# Altium schematic sheet FPGA_Banks_47_48_HP_FMC.SchDoc: Sayma AMC
size 420 x 297 mm; $$Internal___BlkDate: 0:12:25_2-9-18; $$Internal_NAME_PLACEHOLDER: a3sheet; $$Internal_Resolution: 00001mm; $$NotCommonProperty_@NAME: FPGA_XCKU040FFVA1156; $$NotCommonProperty_@PRINTORDER: 17; $$NotCommonProperty_@SHEET: FPGA Banks 47 48 HP FMC; $$NotCommonProperty_@SHEETTOTAL: 30; CmpIndex: 989; Drawing Author: G.Kasprowicz; Drawing Number: Sayma AMC; Drawing Project: AMC FMC Carrier Board; Drawing Revision: 2.0; SymIndex: 2141; CheckedBy: P.Kulik,T.Przywozki,W.Ruclo; Author: G.Kasprowicz; CompanyName: WUT ISE; DrawnBy: G.Kasprowicz; Organization: WUT ISE; Address1: PW ISE; Address2: Nowowiejska 15/19 00-665 Warsaw; Address3: gkasprow@gmail.com; DocumentNumber: 25; Revision: 2; SheetNumber: 25; SheetTotal: 32; ModifiedBy: -; CheckedDate: -; Title2: FPGA banks 47 & 48 - FMC; DivGrp: WUT ISE; Designer: G.Kasprowicz; ModifiedDate: -; ProjectName: Sensor Box
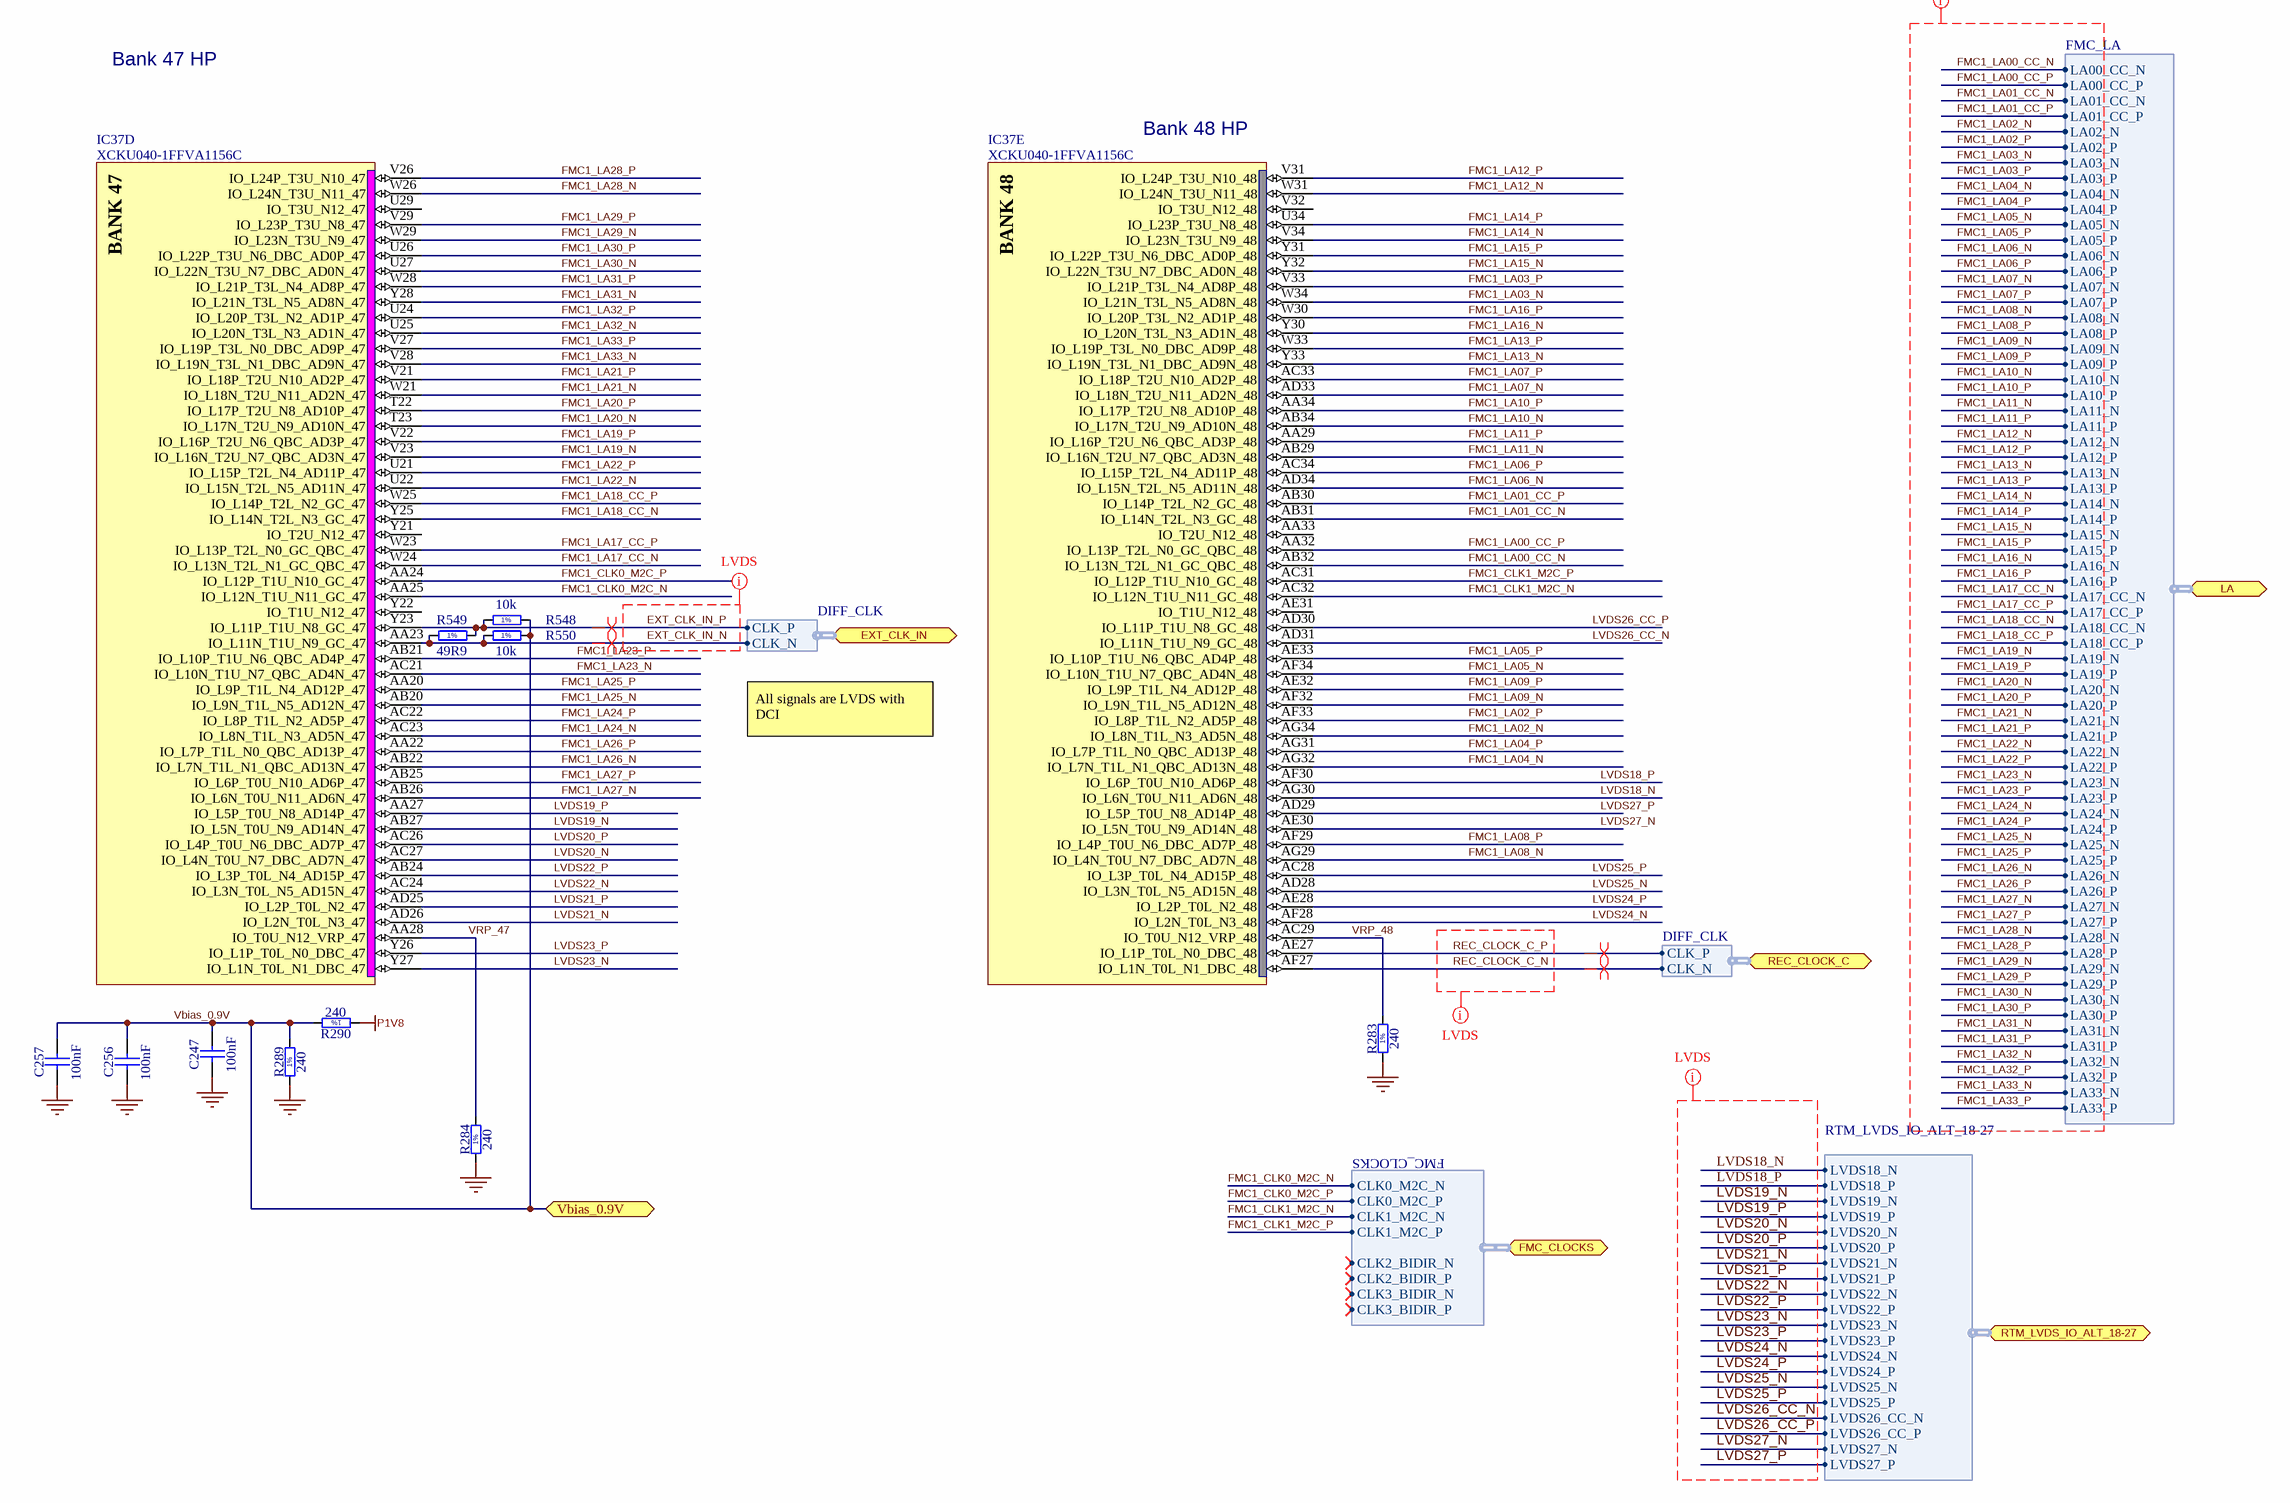
[diagram p0: FPGA_Banks_47_48_HP_FMC.SchDoc]

## Parts
C247  100nF  [CAPC0603X33N]
C256  100nF  [CAPC0603X33N]
C257  100nF  [CAPC0603X33N]
IC37  XCKU040-1FFVA1156C  [BGA1156C100P34X34_3500X3500X350]  (parts D,E of 22)
R283  240  [RESC1005X40N]
R284  240  [RESC1005X40N]
R289  240  [RESC1005X40N]
R290  240  [RESC1005X40N]
R548  10k  [RESC1005X40N]
R549  49R9  [RESC1005X40N]
R550  10k  [RESC1005X40N]

## Ports
EXT_CLK_IN (bidir, harness DIFF_CLK), FMC_CLOCKS (bidir, harness FMC_CLOCKS), LA (bidir, harness FMC_LA), REC_CLOCK_C (bidir, harness DIFF_CLK), RTM_LVDS_IO_ALT_18-27 (bidir, harness RTM_LVDS_IO_ALT_18-27), Vbias_0.9V (bidir)

## Harnesses
RTM_LVDS_IO_ALT_18-27: LVDS19_N, LVDS19_P, LVDS20_N, LVDS20_P, LVDS21_N, LVDS21_P, LVDS22_N, LVDS22_P, LVDS23_N, LVDS23_P, LVDS24_N, LVDS24_P, LVDS25_N, LVDS25_P, LVDS26_CC_N, LVDS26_CC_P, LVDS27_N, LVDS27_P, LVDS18_N, LVDS18_P
FMC_LA: LA00_CC_N, LA00_CC_P, LA01_CC_N, LA01_CC_P, LA02_N, LA02_P, LA03_N, LA03_P, LA04_N, LA04_P, LA05_N, LA05_P, LA06_N, LA06_P, LA07_N, LA07_P, LA08_N, LA08_P, LA09_N, LA09_P, LA10_N, LA10_P, LA11_N, LA11_P, LA12_N, LA12_P, LA13_N, LA13_P, LA14_N, LA14_P, LA15_N, LA15_P, LA16_N, LA16_P, LA17_CC_N, LA17_CC_P, LA18_CC_N, LA18_CC_P, LA19_N, LA19_P, LA20_N, LA20_P, LA21_N, LA21_P, LA22_N, LA22_P, LA23_N, LA23_P, LA24_N, LA25_N, LA25_P, LA24_P, LA26_N, LA26_P, LA27_N, LA27_P, LA28_N, LA28_P, LA29_N, LA29_P, LA30_N, LA30_P, LA31_N, LA31_P, LA32_N, LA32_P, LA33_N, LA33_P
FMC_CLOCKS: CLK0_M2C_N, CLK0_M2C_P, CLK1_M2C_N, CLK1_M2C_P, CLK2_BIDIR_N, CLK2_BIDIR_P, CLK3_BIDIR_N, CLK3_BIDIR_P
DIFF_CLK: CLK_N, CLK_P

## Nets
GND: C247.2 C256.2 C257.2 R283.1 R284.1 R289.1
P1V8: R290.1
EXT_CLK_IN_N: IC37.AA23(IO_L11N_T1U_N9_GC_47) R549.1 R550.1 ; port EXT_CLK_IN.CLK_N
EXT_CLK_IN_P: IC37.Y23(IO_L11P_T1U_N8_GC_47) R548.1 R549.2 ; port EXT_CLK_IN.CLK_P
FMC1_CLK0_M2C_N: IC37.AA25(IO_L12N_T1U_N11_GC_47) ; port FMC_CLOCKS.CLK0_M2C_N
FMC1_CLK0_M2C_P: IC37.AA24(IO_L12P_T1U_N10_GC_47) ; port FMC_CLOCKS.CLK0_M2C_P
FMC1_CLK1_M2C_N: IC37.AC32(IO_L12N_T1U_N11_GC_48) ; port FMC_CLOCKS.CLK1_M2C_N
FMC1_CLK1_M2C_P: IC37.AC31(IO_L12P_T1U_N10_GC_48) ; port FMC_CLOCKS.CLK1_M2C_P
FMC1_LA00_CC_N: IC37.AB32(IO_L13N_T2L_N1_GC_QBC_48) ; port LA.LA00_CC_N
FMC1_LA00_CC_P: IC37.AA32(IO_L13P_T2L_N0_GC_QBC_48) ; port LA.LA00_CC_P
FMC1_LA01_CC_N: IC37.AB31(IO_L14N_T2L_N3_GC_48) ; port LA.LA01_CC_N
FMC1_LA01_CC_P: IC37.AB30(IO_L14P_T2L_N2_GC_48) ; port LA.LA01_CC_P
FMC1_LA02_N: IC37.AG34(IO_L8N_T1L_N3_AD5N_48) ; port LA.LA02_N
FMC1_LA02_P: IC37.AF33(IO_L8P_T1L_N2_AD5P_48) ; port LA.LA02_P
FMC1_LA03_N: IC37.W34(IO_L21N_T3L_N5_AD8N_48) ; port LA.LA03_N
FMC1_LA03_P: IC37.V33(IO_L21P_T3L_N4_AD8P_48) ; port LA.LA03_P
FMC1_LA04_N: IC37.AG32(IO_L7N_T1L_N1_QBC_AD13N_48) ; port LA.LA04_N
FMC1_LA04_P: IC37.AG31(IO_L7P_T1L_N0_QBC_AD13P_48) ; port LA.LA04_P
FMC1_LA05_N: IC37.AF34(IO_L10N_T1U_N7_QBC_AD4N_48) ; port LA.LA05_N
FMC1_LA05_P: IC37.AE33(IO_L10P_T1U_N6_QBC_AD4P_48) ; port LA.LA05_P
FMC1_LA06_N: IC37.AD34(IO_L15N_T2L_N5_AD11N_48) ; port LA.LA06_N
FMC1_LA06_P: IC37.AC34(IO_L15P_T2L_N4_AD11P_48) ; port LA.LA06_P
FMC1_LA07_N: IC37.AD33(IO_L18N_T2U_N11_AD2N_48) ; port LA.LA07_N
FMC1_LA07_P: IC37.AC33(IO_L18P_T2U_N10_AD2P_48) ; port LA.LA07_P
FMC1_LA08_N: IC37.AG29(IO_L4N_T0U_N7_DBC_AD7N_48) ; port LA.LA08_N
FMC1_LA08_P: IC37.AF29(IO_L4P_T0U_N6_DBC_AD7P_48) ; port LA.LA08_P
FMC1_LA09_N: IC37.AF32(IO_L9N_T1L_N5_AD12N_48) ; port LA.LA09_N
FMC1_LA09_P: IC37.AE32(IO_L9P_T1L_N4_AD12P_48) ; port LA.LA09_P
FMC1_LA10_N: IC37.AB34(IO_L17N_T2U_N9_AD10N_48) ; port LA.LA10_N
FMC1_LA10_P: IC37.AA34(IO_L17P_T2U_N8_AD10P_48) ; port LA.LA10_P
FMC1_LA11_N: IC37.AB29(IO_L16N_T2U_N7_QBC_AD3N_48) ; port LA.LA11_N
FMC1_LA11_P: IC37.AA29(IO_L16P_T2U_N6_QBC_AD3P_48) ; port LA.LA11_P
FMC1_LA12_N: IC37.W31(IO_L24N_T3U_N11_48) ; port LA.LA12_N
FMC1_LA12_P: IC37.V31(IO_L24P_T3U_N10_48) ; port LA.LA12_P
FMC1_LA13_N: IC37.Y33(IO_L19N_T3L_N1_DBC_AD9N_48) ; port LA.LA13_N
FMC1_LA13_P: IC37.W33(IO_L19P_T3L_N0_DBC_AD9P_48) ; port LA.LA13_P
FMC1_LA14_N: IC37.V34(IO_L23N_T3U_N9_48) ; port LA.LA14_N
FMC1_LA14_P: IC37.U34(IO_L23P_T3U_N8_48) ; port LA.LA14_P
FMC1_LA15_N: IC37.Y32(IO_L22N_T3U_N7_DBC_AD0N_48) ; port LA.LA15_N
FMC1_LA15_P: IC37.Y31(IO_L22P_T3U_N6_DBC_AD0P_48) ; port LA.LA15_P
FMC1_LA16_N: IC37.Y30(IO_L20N_T3L_N3_AD1N_48) ; port LA.LA16_N
FMC1_LA16_P: IC37.W30(IO_L20P_T3L_N2_AD1P_48) ; port LA.LA16_P
FMC1_LA17_CC_N: IC37.W24(IO_L13N_T2L_N1_GC_QBC_47) ; port LA.LA17_CC_N
FMC1_LA17_CC_P: IC37.W23(IO_L13P_T2L_N0_GC_QBC_47) ; port LA.LA17_CC_P
FMC1_LA18_CC_N: IC37.Y25(IO_L14N_T2L_N3_GC_47) ; port LA.LA18_CC_N
FMC1_LA18_CC_P: IC37.W25(IO_L14P_T2L_N2_GC_47) ; port LA.LA18_CC_P
FMC1_LA19_N: IC37.V23(IO_L16N_T2U_N7_QBC_AD3N_47) ; port LA.LA19_N
FMC1_LA19_P: IC37.V22(IO_L16P_T2U_N6_QBC_AD3P_47) ; port LA.LA19_P
FMC1_LA20_N: IC37.T23(IO_L17N_T2U_N9_AD10N_47) ; port LA.LA20_N
FMC1_LA20_P: IC37.T22(IO_L17P_T2U_N8_AD10P_47) ; port LA.LA20_P
FMC1_LA21_N: IC37.W21(IO_L18N_T2U_N11_AD2N_47) ; port LA.LA21_N
FMC1_LA21_P: IC37.V21(IO_L18P_T2U_N10_AD2P_47) ; port LA.LA21_P
FMC1_LA22_N: IC37.U22(IO_L15N_T2L_N5_AD11N_47) ; port LA.LA22_N
FMC1_LA22_P: IC37.U21(IO_L15P_T2L_N4_AD11P_47) ; port LA.LA22_P
FMC1_LA23_N: IC37.AC21(IO_L10N_T1U_N7_QBC_AD4N_47) ; port LA.LA23_N
FMC1_LA23_P: IC37.AB21(IO_L10P_T1U_N6_QBC_AD4P_47) ; port LA.LA23_P
FMC1_LA24_N: IC37.AC23(IO_L8N_T1L_N3_AD5N_47) ; port LA.LA24_N
FMC1_LA24_P: IC37.AC22(IO_L8P_T1L_N2_AD5P_47) ; port LA.LA24_P
FMC1_LA25_N: IC37.AB20(IO_L9N_T1L_N5_AD12N_47) ; port LA.LA25_N
FMC1_LA25_P: IC37.AA20(IO_L9P_T1L_N4_AD12P_47) ; port LA.LA25_P
FMC1_LA26_N: IC37.AB22(IO_L7N_T1L_N1_QBC_AD13N_47) ; port LA.LA26_N
FMC1_LA26_P: IC37.AA22(IO_L7P_T1L_N0_QBC_AD13P_47) ; port LA.LA26_P
FMC1_LA27_N: IC37.AB26(IO_L6N_T0U_N11_AD6N_47) ; port LA.LA27_N
FMC1_LA27_P: IC37.AB25(IO_L6P_T0U_N10_AD6P_47) ; port LA.LA27_P
FMC1_LA28_N: IC37.W26(IO_L24N_T3U_N11_47) ; port LA.LA28_N
FMC1_LA28_P: IC37.V26(IO_L24P_T3U_N10_47) ; port LA.LA28_P
FMC1_LA29_N: IC37.W29(IO_L23N_T3U_N9_47) ; port LA.LA29_N
FMC1_LA29_P: IC37.V29(IO_L23P_T3U_N8_47) ; port LA.LA29_P
FMC1_LA30_N: IC37.U27(IO_L22N_T3U_N7_DBC_AD0N_47) ; port LA.LA30_N
FMC1_LA30_P: IC37.U26(IO_L22P_T3U_N6_DBC_AD0P_47) ; port LA.LA30_P
FMC1_LA31_N: IC37.Y28(IO_L21N_T3L_N5_AD8N_47) ; port LA.LA31_N
FMC1_LA31_P: IC37.W28(IO_L21P_T3L_N4_AD8P_47) ; port LA.LA31_P
FMC1_LA32_N: IC37.U25(IO_L20N_T3L_N3_AD1N_47) ; port LA.LA32_N
FMC1_LA32_P: IC37.U24(IO_L20P_T3L_N2_AD1P_47) ; port LA.LA32_P
FMC1_LA33_N: IC37.V28(IO_L19N_T3L_N1_DBC_AD9N_47) ; port LA.LA33_N
FMC1_LA33_P: IC37.V27(IO_L19P_T3L_N0_DBC_AD9P_47) ; port LA.LA33_P
LVDS18_N: IC37.AG30(IO_L6N_T0U_N11_AD6N_48) ; port RTM_LVDS_IO_ALT_18-27.LVDS18_N
LVDS18_P: IC37.AF30(IO_L6P_T0U_N10_AD6P_48) ; port RTM_LVDS_IO_ALT_18-27.LVDS18_P
LVDS19_N: IC37.AB27(IO_L5N_T0U_N9_AD14N_47) ; port RTM_LVDS_IO_ALT_18-27.LVDS19_N
LVDS19_P: IC37.AA27(IO_L5P_T0U_N8_AD14P_47) ; port RTM_LVDS_IO_ALT_18-27.LVDS19_P
LVDS20_N: IC37.AC27(IO_L4N_T0U_N7_DBC_AD7N_47) ; port RTM_LVDS_IO_ALT_18-27.LVDS20_N
LVDS20_P: IC37.AC26(IO_L4P_T0U_N6_DBC_AD7P_47) ; port RTM_LVDS_IO_ALT_18-27.LVDS20_P
LVDS21_N: IC37.AD26(IO_L2N_T0L_N3_47) ; port RTM_LVDS_IO_ALT_18-27.LVDS21_N
LVDS21_P: IC37.AD25(IO_L2P_T0L_N2_47) ; port RTM_LVDS_IO_ALT_18-27.LVDS21_P
LVDS22_N: IC37.AC24(IO_L3N_T0L_N5_AD15N_47) ; port RTM_LVDS_IO_ALT_18-27.LVDS22_N
LVDS22_P: IC37.AB24(IO_L3P_T0L_N4_AD15P_47) ; port RTM_LVDS_IO_ALT_18-27.LVDS22_P
LVDS23_N: IC37.Y27(IO_L1N_T0L_N1_DBC_47) ; port RTM_LVDS_IO_ALT_18-27.LVDS23_N
LVDS23_P: IC37.Y26(IO_L1P_T0L_N0_DBC_47) ; port RTM_LVDS_IO_ALT_18-27.LVDS23_P
LVDS24_N: IC37.AF28(IO_L2N_T0L_N3_48) ; port RTM_LVDS_IO_ALT_18-27.LVDS24_N
LVDS24_P: IC37.AE28(IO_L2P_T0L_N2_48) ; port RTM_LVDS_IO_ALT_18-27.LVDS24_P
LVDS25_N: IC37.AD28(IO_L3N_T0L_N5_AD15N_48) ; port RTM_LVDS_IO_ALT_18-27.LVDS25_N
LVDS25_P: IC37.AC28(IO_L3P_T0L_N4_AD15P_48) ; port RTM_LVDS_IO_ALT_18-27.LVDS25_P
LVDS26_CC_N: IC37.AD31(IO_L11N_T1U_N9_GC_48) ; port RTM_LVDS_IO_ALT_18-27.LVDS26_CC_N
LVDS26_CC_P: IC37.AD30(IO_L11P_T1U_N8_GC_48) ; port RTM_LVDS_IO_ALT_18-27.LVDS26_CC_P
LVDS27_N: IC37.AE30(IO_L5N_T0U_N9_AD14N_48) ; port RTM_LVDS_IO_ALT_18-27.LVDS27_N
LVDS27_P: IC37.AD29(IO_L5P_T0U_N8_AD14P_48) ; port RTM_LVDS_IO_ALT_18-27.LVDS27_P
REC_CLOCK_C_N: IC37.AF27(IO_L1N_T0L_N1_DBC_48) ; port REC_CLOCK_C.CLK_N
REC_CLOCK_C_P: IC37.AE27(IO_L1P_T0L_N0_DBC_48) ; port REC_CLOCK_C.CLK_P
Vbias_0.9V: C247.1 C256.1 C257.1 R289.2 R290.2 R548.2 R550.2 ; port Vbias_0.9V
VRP_47: IC37.AA28(IO_T0U_N12_VRP_47) R284.2
VRP_48: IC37.AC29(IO_T0U_N12_VRP_48) R283.2

Not connected (* = marked no-connect by the designer): IC37 AA33(IO_T2U_N12_48) AE31(IO_T1U_N12_48) U29(IO_T3U_N12_47) V32(IO_T3U_N12_48) Y21(IO_T2U_N12_47) Y22(IO_T1U_N12_47)

## Layout directives
differential pair: EXT_CLK_IN_N, EXT_CLK_IN_P, REC_CLOCK_C_N, REC_CLOCK_C_P
net class LVDS: EXT_CLK_IN_N, EXT_CLK_IN_P, LVDS18_N, LVDS18_P, LVDS19_N, LVDS19_P, LVDS20_N, LVDS20_P, LVDS21_N, LVDS21_P, LVDS22_N, LVDS22_P, LVDS23_N, LVDS23_P, LVDS24_N, LVDS24_P, LVDS25_N, LVDS25_P, LVDS26_CC_N, LVDS26_CC_P, LVDS27_N, LVDS27_P, REC_CLOCK_C_N, REC_CLOCK_C_P
net class LVDS_FMC: FMC1_LA00_CC_N, FMC1_LA00_CC_P, FMC1_LA01_CC_N, FMC1_LA01_CC_P, FMC1_LA02_N, FMC1_LA02_P, FMC1_LA03_N, FMC1_LA03_P, FMC1_LA04_N, FMC1_LA04_P, FMC1_LA05_N, FMC1_LA05_P, FMC1_LA06_N, FMC1_LA06_P, FMC1_LA07_N, FMC1_LA07_P, FMC1_LA08_N, FMC1_LA08_P, FMC1_LA09_N, FMC1_LA09_P, FMC1_LA10_N, FMC1_LA10_P, FMC1_LA11_N, FMC1_LA11_P, FMC1_LA12_N, FMC1_LA12_P, FMC1_LA13_N, FMC1_LA13_P, FMC1_LA14_N, FMC1_LA14_P, FMC1_LA15_N, FMC1_LA15_P, FMC1_LA16_N, FMC1_LA16_P, FMC1_LA17_CC_N, FMC1_LA17_CC_P, FMC1_LA18_CC_N, FMC1_LA18_CC_P, FMC1_LA19_N, FMC1_LA19_P, FMC1_LA20_N, FMC1_LA20_P, FMC1_LA21_N, FMC1_LA21_P, FMC1_LA22_N, FMC1_LA22_P, FMC1_LA23_N, FMC1_LA23_P, FMC1_LA24_N, FMC1_LA24_P, FMC1_LA25_N, FMC1_LA25_P, FMC1_LA26_N, FMC1_LA26_P, FMC1_LA27_N, FMC1_LA27_P, FMC1_LA28_N, FMC1_LA28_P, FMC1_LA29_N, FMC1_LA29_P, FMC1_LA30_N, FMC1_LA30_P, FMC1_LA31_N, FMC1_LA31_P, FMC1_LA32_N, FMC1_LA32_P, FMC1_LA33_N, FMC1_LA33_P

## Notes on the sheet
- Bank 47 HP
- (near IC37) Bank 48 HP
- All signals are LVDS with DCI
- Project/Equipment
- Document
- Designer
- Drawn by
- Check.by
- Copyright WUT ISE 2018.
  This documentation describes Open Hardware and is licensed under the CERN OHL v.1.1. You may redistribute and modify this documentation under the terms of the CERN OHL v.1.1. (http://ohwr.org/CERNOHL). This documentation is distributed WITHOUT ANY EXPRESS OR IMPLIED WARRANTY, INCLUDING OF MERCHANTABILITY, SATISFACTORY QUALITY AND FITNESS FOR A PARTICULAR PURPOSE. Please see the CERN OHL v.1.1 for applicable conditions.
- Contact
- File
- Last Mod.
- Print Date
- Sheet
- Size
- A3
- of
- Rev
- (in symbol R0402_10K_1%_0.0625W_100PPM) 1%
- (in symbol R0402_49R9_1%_0.0625W_100PPM) 1%
- (in symbol R0402_240R_1%_0.0625W_100PPM) 1%
- (in symbol XCKU040-1FFVA1156C, part D) BANK 47
- (in symbol XCKU040-1FFVA1156C, part E) BANK 48

## Library data of the parts
C247 C256 C257 = CC0201_100NF_6.3V_10%_X5R: Non-polarised capacitor; Manufacturer: GENERIC; Part Description: SMD Multilayer Chip Ceramic Capacitor; Manufacturer1 Part Number: 02016D104KAT2A; Tolerance: ±10%; Voltage: 6.3V; TC: X5R; Manufacturer Part Number: CC0201_100NF_6.3V_10%_X5R; Part Number: CC0201_100NF_6.3V_10%_X5R; Value: 100nF; Component Kind: Standard; Component Type: Standard; Pin Count: 2; Status: Not Recommended; Case: 0201; Mounted: Yes; Socket: No; SMD: Yes; Sense: No; Manufacturer1 Example: AVX; Manufacturer1 ComponentHeight: 0.33mm; HelpURL: \\cern.ch\dfs\Applications\Altium\Datasheets\CC0201_X5R_AVX.pdf; Author: CERN DEM JLC; CreateDate: 03.12.2007; LatestRevisionDate: 03.12.2007
IC37 = XCKU040-1FFVA1156C: Kintex UltraScale FPGA, 520 I/O, 530K Cells, 1156-Ball BGA, Speed Grade 1, Commercial Grade; Manufacturer: XILINX; Part Description: Kintex UltraScale, 40 DLL I/O, 416 HP I/O, 104 HR I/O, 1156-Pin BGA, Speed Grade 1, Commercial Grade; PressFit: No; Bonding: No; Manufacturer Part Number: XCKU040-1FFVA1156C; PackageDescription: BGA, 1.00mm Pitch, Square; 1156 Pin, 34 Columns X 34 Rows, Body 35.00mm X 35.00mm X 3.50mm H, IPC Medium Density; Part Number: XCKU040-1FFVA1156C; Component Kind: Standard; Component Type: Standard; Device: XCKU040-1FFVA1156C; Pin Count: 1156; Case: BGA1156; Mounted: Yes; Socket: No; SMD: Yes; Sense: No; ComponentHeight: 3.5mm; HelpURL: \\cern.ch\dfs\Applications\Altium\Datasheets\XCKU040-1FFVA1156C.pdf; ComponentLink1URL: \\cern.ch\dfs\Applications\Altium\Datasheets\XCKU040-1FFVA1156C_Package-Pinout.pdf; ComponentLink1Description: Package/Pinout; Author: CERN DEM CA; CreateDate: 16.08.2016; LatestRevisionDate: 16.08.2016
R283 R284 R289 R290 = R0402_240R_1%_0.0625W_100PPM: Resistor - 1%; Manufacturer: GENERIC; Part Description: General Purpose Thick Film Chip Resistor; Manufacturer1 Part Number: 232270672401L; TC: ±100ppm/°C; PressFit: No; Manufacturer Part Number: R0402_240R_1%_0.0625W_100PPM; Part Number: R0402_240R_1%_0.0625W_100PPM; Tolerance: ±1%; Value: 240; Component Kind: Standard; Component Type: Standard; Pin Count: 2; Status: Not Recommended; Power: 0.0625W; Case: 0402; Mounted: Yes; Sense: No; Socket: No; SMD: Yes; Manufacturer1 Example: YAGEO PHYCOMP; Manufacturer1 ComponentHeight: 0.4mm; HelpURL: \\cern.ch\dfs\Applications\Altium\Datasheets\R0402_Phycomp_RC0402.pdf; Author: CERN DEM JLC; CreateDate: 03.12.2007; LatestRevisionDate: 17.10.2012
R548 R550 = R0402_10K_1%_0.0625W_100PPM: Resistor - 1%; Manufacturer: GENERIC; Part Description: General Purpose Thick Film Chip Resistor; Manufacturer1 Part Number: 232270671003L; TC: ±100ppm/°C; PressFit: No; Manufacturer Part Number: R0402_10K_1%_0.0625W_100PPM; Part Number: R0402_10K_1%_0.0625W_100PPM; Tolerance: ±1%; Value: 10k; Component Kind: Standard; Component Type: Standard; Pin Count: 2; Status: Not Recommended; Power: 0.0625W; Case: 0402; Mounted: Yes; Sense: No; Socket: No; SMD: Yes; Manufacturer1 Example: YAGEO PHYCOMP; Manufacturer1 ComponentHeight: 0.4mm; HelpURL: \\cern.ch\dfs\Applications\Altium\Datasheets\R0402_Phycomp_RC0402.pdf; Author: CERN DEM JLC; CreateDate: 03.12.2007; LatestRevisionDate: 17.10.2012
R549 = R0402_49R9_1%_0.0625W_100PPM: Resistor - 1%; Manufacturer: GENERIC; Part Description: General Purpose Thick Film Chip Resistor; Manufacturer1 Part Number: 232270674999L or RC0402FR-0749R9L; TC: ±100ppm/°C; PressFit: No; Manufacturer Part Number: R0402_49R9_1%_0.0625W_100PPM; Part Number: R0402_49R9_1%_0.0625W_100PPM; Tolerance: ±1%; Value: 49R9; Component Kind: Standard; Component Type: Standard; Pin Count: 2; Status: Not Recommended; Power: 0.0625W; Case: 0402; Mounted: Yes; Sense: No; Socket: No; SMD: Yes; Manufacturer1 Example: YAGEO PHYCOMP; Manufacturer1 ComponentHeight: 0.4mm; HelpURL: \\cern.ch\dfs\Applications\Altium\Datasheets\R0402_Phycomp_RC0402.pdf; Author: CERN DEM JLC; CreateDate: 24.10.2012; LatestRevisionDate: 24.10.2012